# Altium schematic sheet p05_leds.SchDoc
size A
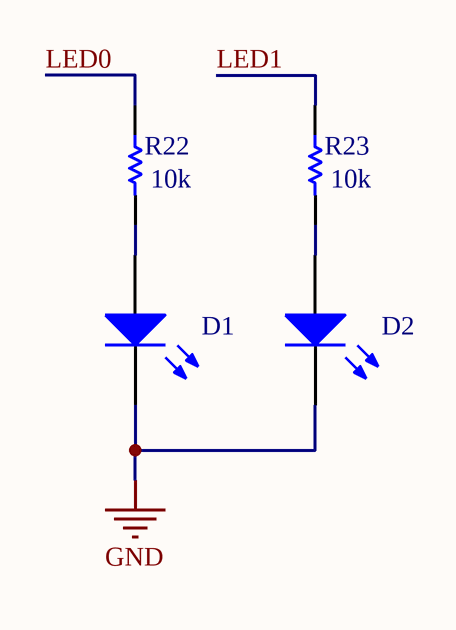
[diagram p0: p05_leds.SchDoc]

## Parts
D1  LED0  [6-0805_M]  (value not drawn)
D2  LED0  [6-0805_M]  (value not drawn)
R22  value 10k  [6-0805_M]  (hidden comment: Res1)
R23  value 10k  [6-0805_M]  (hidden comment: Res1)

## Nets
GND: D1.2(K) D2.2(K)
LED0: R22.1
LED1: R23.1
NetD1_1: D1.1(A) R22.2
NetD2_1: D2.1(A) R23.2

## Library data of the parts
D1 D2 = LED0: Typical INFRARED GaAs LED; Published: 8-Jun-2000; LatestRevisionDate: 08-Jul-2005; LatestRevisionNote: Mech Layer 1 removed.; PackageReference: LED-0; Publisher: Altium Limited; PackageDescription: LED; 2 Leads
R22 R23 = Res1: Resistor; Published: 8-Jun-2000; LatestRevisionDate: 17-Jul-2002; LatestRevisionNote: Re-released for DXP Platform.; PackageReference: AXIAL-0.3; Publisher: Altium Limited; PackageDescription: Axial Device, Thru-Hole; 2 Leads; 0.3 in Pin Spacing